# EAGLE design 14044-sparkfun-mlx90640-qwiic-breakout-panel-new (EAGLE 9.0.1)
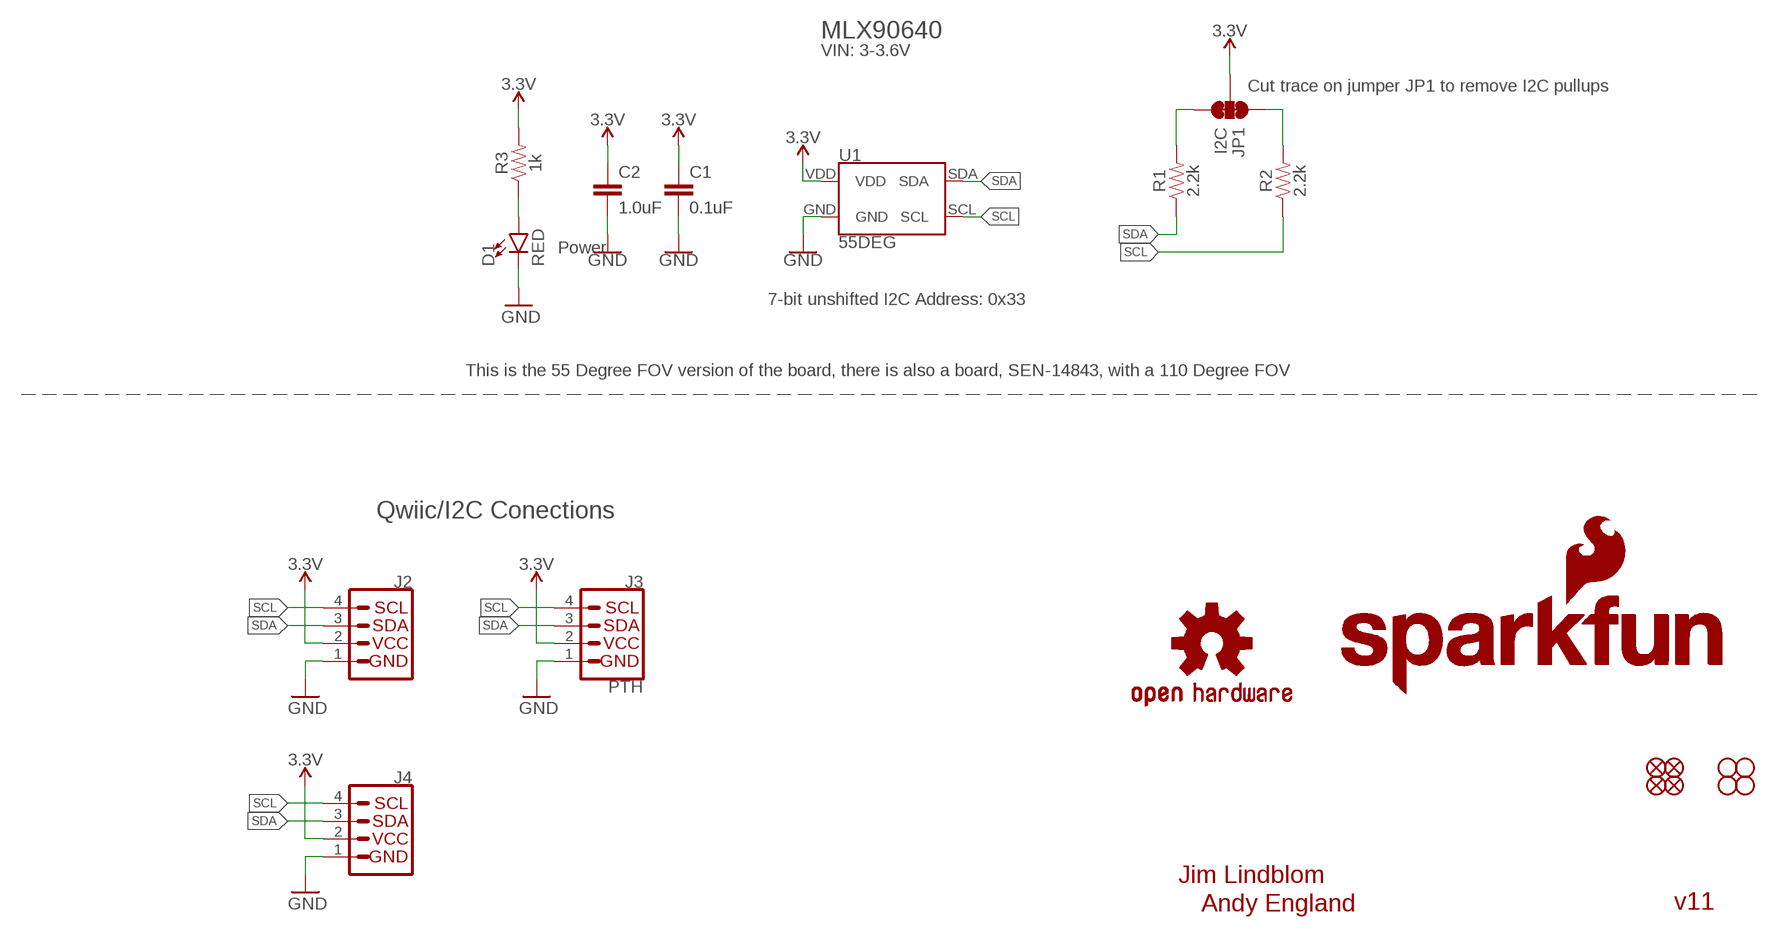
[diagram p0: schematic, sheet 1]

## Parts
C1  0.1uF  0.1UF-0603-25V-(+80/-20%)  [0603]
C2  1.0uF  1.0UF-0603-16V-10%  [0603]
D1  RED  LED-RED0603  [LED-0603]
J2  QWIIC_CONNECTORJS-1MM  [1X04_1MM_RA]
J3  PTH  I2C_STANDARD_NO_SILK  [1X04_NO_SILK]
J4  QWIIC_CONNECTORJS-1MM  [1X04_1MM_RA]
JP1  I2C  JUMPER-SMT_3_2-NC_TRACE_NO-SILK  [SMT-JUMPER_3_2-NC_TRACE_NO-SILK]
JP2  FIDUCIALUFIDUCIAL  [MICRO-FIDUCIAL]
JP3  STAND-OFF  [STAND-OFF]
JP4  STAND-OFF  [STAND-OFF]
JP5  FIDUCIALUFIDUCIAL  [MICRO-FIDUCIAL]
JP6  FIDUCIALUFIDUCIAL  [MICRO-FIDUCIAL]
JP7  FIDUCIALUFIDUCIAL  [MICRO-FIDUCIAL]
JP8  STAND-OFF  [STAND-OFF]
JP9  STAND-OFF  [STAND-OFF]
LOGO1  OSHW-LOGOMINI  [OSHW-LOGO-MINI]
LOGO2  SFE_LOGO_NAME_FLAME.1_INCH  [SFE_LOGO_NAME_FLAME_.1]
LOGO3  SFE_LOGO_NAME.1_INCH  [SFE_LOGO_NAME_.1]
R1  2.2k  2.2KOHM-0603-1/10W-1%  [0603]
R2  2.2k  2.2KOHM-0603-1/10W-1%  [0603]
R3  1k  1KOHM-0603-1/10W-1%  [0603]
U1  55DEG  MLX90540_MLX90640  [MLX90540_MLX90640]

## Nets
3.3V: C1.1 C2.1 J2.2 J3.2(VCC) J4.2 JP1.2 R3.2 U1.VDD
GND: C1.2 C2.2 D1.C J2.1 J3.1(GND) J4.1 U1.GND
N$1: JP1.3 R1.2
N$2: JP1.1 R2.2
N$3: D1.A R3.1
SCL: J2.4 J3.4(SCL) J4.4 R2.1 U1.SCL
SDA: J2.3 J3.3(SDA) J4.3 R1.1 U1.SDA

## Notes on the sheet
- MLX90640
- VIN: 3-3.6V
- Cut trace on jumper JP1 to remove I2C pullups
- Power
- 7-bit unshifted I2C Address: 0x33
- This is the 55 Degree FOV version of the board, there is also a board, SEN-14843, with a 110 Degree FOV
- Qwiic/I2C Conections
- Jim Lindblom
- Andy England | v11

## Library data of the parts
C1 = SparkFun-Capacitors:0.1UF: 0.1µF ceramic capacitors A capacitor is a passive two-terminal electrical component used to store electrical energy temporarily in an electric field.; PROD_ID: CAP-00810
C2 = SparkFun-Capacitors:1.0UF: 1µF ceramic capacitors A capacitor is a passive two-terminal electrical component used to store electrical energy temporarily in an electric field.; PROD_ID: CAP-00868
D1 = SparkFun-LED:LED-RED: Red SMD LED Used in manufacturing of most products at SparkFun Packages: 0603 - SMD 0603 package [Product Link] <http://docs.avagotech.com/docs/AV02-0551EN> 0603 SMART - SMD 0603 SMART package ( more efficient and expensive)[Product Link] <http://www.osram-os.com/Graphics/XPic2/00077099_0.pdf> 1206 - SMD1206 package [Product Link] <https://www.sparkfun.com/datasheets/DevTools/LilyPad/Q150OVS4.pdff> SparkFun Products: Pro Mini 328 -5V <https://www.sparkfun.com/products/821> RedBoard <https://www.sparkfun.com/products/12757> IOIO-OTG <https://www.sparkfun.com/products/13613>; PROD_ID: DIO-00819
J2 J4 = SparkFun-Connectors:QWIIC_CONNECTOR: SparkFun I2C Standard Qwiic Connector An SMD 1mm pitch JST connector makes it easy and quick (get it? Qwiic?) to connect I2C devices to each other. The Qwiic system <http://www.sparkfun.com/qwiic> enables fast and solderless connection between popular platforms and various sensors and actuators. We carry 200mm <https://www.sparkfun.com/products/14204>, 100mm <https://www.sparkfun.com/products/14205>, 50mm <https://www.sparkfun.com/products/14206>, and breadboard friendly <https://www.sparkfun.com/products/14207> Qwiic cables. We also offer 10 pcs strips <https://www.sparkfun.com/products/14323> the SMD connectors.; PROD_ID: CONN-13694
J3 = SparkX:I2C_STANDARD: SparkFun I2C Standard Pinout Header SparkFun has standardized on a pinout for all I2C based sensor breakouts. This pinout allows I2C boards to be plugged directly into the headers on Arduino Uno compatible boards, and to be daisy chained easily. Example SparkFun Products: SparkFun Atmospheric Sensor Breakout - BME280 <https://www.sparkfun.com/products/13676> SparkFun Altitude/Pressure Sensor Breakout - MPL3115A2 <https://www.sparkfun.com/products/11084> SparkFun TOF Range Finder Sensor - VL6180 <https://www.sparkfun.com/products/12785>
JP1 = SparkFun-Jumpers:JUMPER-SMT_3_2-NC_TRACE: Normally closed trace jumper (2 of 2 connections) This jumper has a trace between all three pads so they are normally closed (NC). Use a razor knife to open the connection(s). For best results follow the IPC guidelines for cutting traces: Cutout at least 0.063 mm (0.005 in). Remove all loose material to clean up the cut area. Seal the cut with an approved epoxy. Reapply solder to reclose the connection(s).
JP2 JP5-JP7 = SparkFun:FIDUCIAL: Fiducial Alignment Points Various fiducial points for machine vision alignment.
JP3 JP4 JP8 JP9 = SparkFun:STAND-OFF: Stand Off This is the mechanical footprint for a #4 phillips button head screw. Use the keepout ring to avoid running the screw head into surrounding components. SKU : PRT-00447
LOGO1 = SparkFun-Aesthetics:OSHW-LOGO: Open-Source Hardware (OSHW) Logo This logo indicates the piece of hardware it is found on incorporates a OSHW license and/or adheres to the definition of open source hardware found here: http://freedomdefined.org/OSHW
LOGO2 = SparkFun-Aesthetics:SFE_LOGO_NAME_FLAME: SparkFun Font Logo w/ Flame This is the SparkFun full logo. The logo on the schematic will always be the same size; the package variant is the height of the flame part of the logo. Default layer for the logo on the board is tSilk.
LOGO3 = SparkFun-Aesthetics:SFE_LOGO_NAME: SparkFun Font Logo This is the SparkFun name logo. The logo on the schematic will always be the same size; the package variant is the height of the flame part of the logo (or the height the flame would be, if it were drawn). Default layer for the logo on the board is tSilk.
R1 R2 = SparkFun-Resistors:2.2KOHM: 2.2kΩ resistor A resistor is a passive two-terminal electrical component that implements electrical resistance as a circuit element. Resistors act to reduce current flow, and, at the same time, act to lower voltage levels within circuits. - Wikipedia; PROD_ID: RES-08272
R3 = SparkFun-Resistors:1KOHM: 1kΩ resistor A resistor is a passive two-terminal electrical component that implements electrical resistance as a circuit element. Resistors act to reduce current flow, and, at the same time, act to lower voltage levels within circuits. - Wikipedia; PROD_ID: RES-07856
U1 = SparkFun-IC-Special-Function:MLX90540_MLX90640: Melexis MLX90640 Infrared Array The MLX90640 is a fully calibrated 32x24 pixels thermal IR array in an industry standard 4-lead TO39 package with digital interface.; PROD_ID: IC-14042

## Board
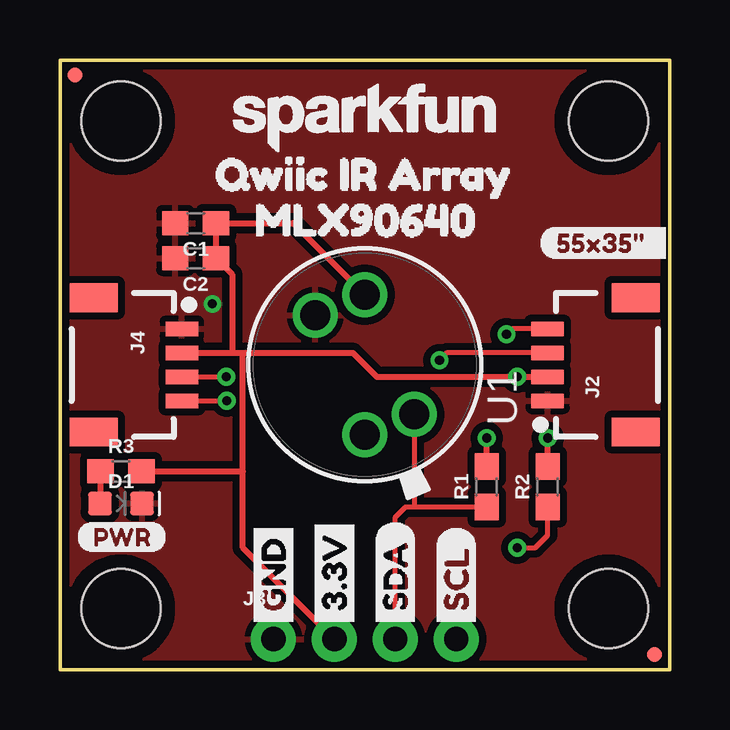
[diagram p1: board, top side]
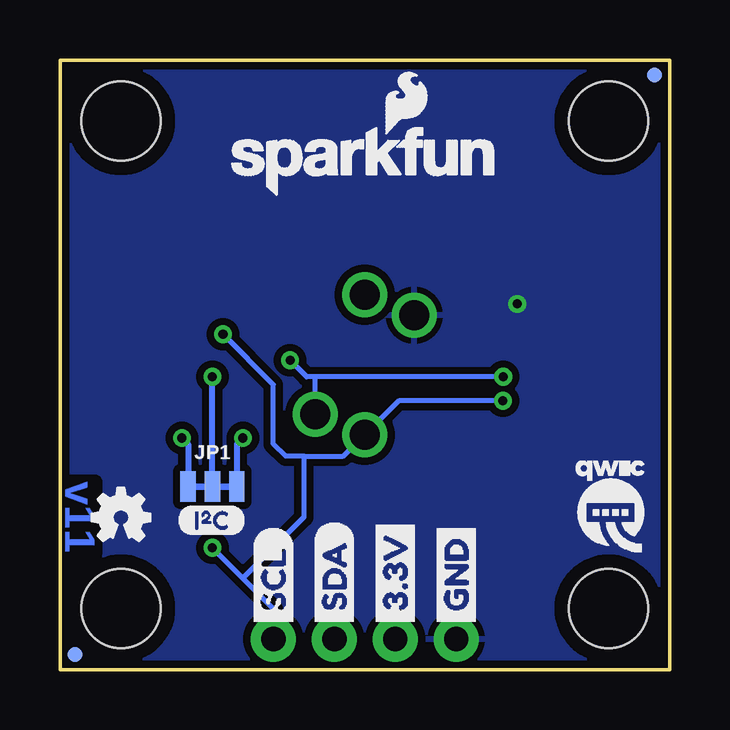
[diagram p2: board, bottom side, seen from below]

Size 25.4 x 25.4 mm. Coordinates in mm from the lower left corner, seen from the top.
Outline: 0,0 25.4,0 25.4,25.4 0,25.4 0,0
Copper layers (1*16): Top 0.035mm / dielectric 1.5mm / Bottom 0.035mm
Design rules "SparkFun-2-layer-TIGHT": minimum track width 7mil, minimum drill 15mil, track to track 7mil, track to pad 7mil, pad to pad 7mil, via to via 7mil, smd to smd 7mil, copper to edge 7mil, drill to drill 7mil, minimum pad ring 7mil, minimum via ring 7mil, stop-mask expansion 4mil, vias tented up to drill 25mil, thermal gap 10mil

### Footprints (pad centres in the part's own frame; a part is rotated, then mirrored left to right if it is on the bottom)
0603 = smd 1.1 x 1: 1 -0.85,0; 2 0.85,0
LED-0603 = smd 1 x 1: A -0.877,0; C 0.877,0
1X04_1MM_RA = smd 0.6 x 1.35: 1 -1.5,0; 2 -0.5,0; 3 0.5,0; 4 1.5,0 | smd 1.2 x 2: NC1 2.8,-3.675; NC2 -2.8,-3.675
1X04_NO_SILK = drill 1.016 pad 1.88: 1 0,0; 2 2.54,0; 3 5.08,0; 4 7.62,0
SMT-JUMPER_3_2-NC_TRACE_NO-SILK = smd 0.635 x 1.27: 1 -1.016,0; 2 0,0; 3 1.016,0
MICRO-FIDUCIAL = smd 0.635 x 0.635: 1 0,0
STAND-OFF = hole 3.302: 0,0
MLX90540_MLX90640 = drill 1.25: GND 2.065,2.065; SCL -2.92,0; SDA -2.065,-2.065; VDD 2.92,0

### Placement (x,y rotation side)
C1  5.65,18.61 180 top
C2  5.65,17.14 180 top
D1  2.54,6.92 0 top
J2  20.32,12.7 90 top
J3  8.89,1.27 0 top
J4  5.08,12.7 270 top
JP1  19.05,7.62 0 bottom
JP2  24.77,0.64 0 top
JP3  2.54,22.86 0 top
JP4  22.86,22.86 0 top
JP5  0.64,24.77 0 top
JP6  24.77,0.64 0 bottom
JP7  0.64,24.77 0 bottom
JP8  2.54,2.54 0 top
JP9  22.86,2.54 0 top
LOGO1  22.86,6.35 0 bottom
LOGO2  18.67,19.68 0 bottom
LOGO3  6.73,21.08 0 top
R1  17.78,7.62 90 top
R2  20.32,7.62 90 top
R3  2.54,8.26 0 top
U1  12.7,12.7 90 top
U$1  [SDA-[)]  13.97,1.52 90 top
U$2  [55X35#__0]  19.94,17.78 0 top
U$4  [SCL-[)]  16.51,1.52 90 top
U$5  [3.3V]  11.43,1.52 90 top
U$6  [GND-04]  8.89,1.52 90 top
U$7  [SDA-[)]  13.97,1.52 90 bottom
U$8  [SCL-[)]  16.51,1.52 90 bottom
U$9  [3.3V]  11.43,1.52 90 bottom
U$10  [GND-04]  8.89,1.52 90 bottom
U$11  [QWIIC-LOGO-SMALL]  2.54,6.79 0 bottom
U$12  [PWR-()-03]  0.7,5.52 0 top
U$13  [MLX906401]  6.99,18.73 0 top
U$14  [QWIIC_IR_ARRAY0]  5.33,20.64 0 top
U$16  [I_SUPER2_C-()-03]  20.51,6.22 0 bottom

### Tracks (layer width: path | path; a pad name or v marks a point on that pad's centre or on a via)
3.3V  (via drill 0.38)
  Top 0.254: J4.2 7.18,13.2 | 7.18,13.2 7.62,13.2 | 7.62,13.2 12.2,13.2 13.2,12.2 v19.05,12.2 J2.2 | J3.2 7.62,5.08 7.62,8.26 | 7.62,8.26 7.62,13.2 | R3.2 7.62,8.26 | 7.18,13.2 7.18,16.47 C2.1 C1.1 9.71,18.61 U1.VDD
  Bottom 0.254: JP1.2 v19.05,12.2
GND  (via drill 0.38)
  other vias: 6.35,15.24
  pour Top (isolate 0.305): 0,0 0,25.4 25.4,25.4 25.4,0
  pour Bottom (isolate 0.305): 0,0 0,25.4 25.4,25.4 25.4,0
N$1  (via drill 0.38)
  Top 0.254: R1.2 v17.78,9.65
  Bottom 0.254: v17.78,9.65 18.03,9.4 JP1.3
N$2  (via drill 0.38)
  Top 0.254: R2.2 v20.32,9.65
  Bottom 0.254: v20.32,9.65 20.07,9.4 JP1.1
N$3
  Top 0.254: D1.A 1.69,6.95 R3.1
SCL  (via drill 0.38)
  Top 0.203: J4.4 v6.95,11.2 | J2.4 18.84,14.2 v18.61,13.97 | v19.05,5.08 19.81,5.08 20.32,5.59 R2.1
  Bottom 0.203: v6.95,11.2 11.28,11.2 U1.SCL 13.59,8.89 15.24,8.89 | v18.61,13.97 16.51,11.87 16.51,9.4 16,8.89 15.24,8.89 | J3.4 16.51,2.54 17.78,3.81 | 17.78,3.81 v19.05,5.08 | 15.24,8.89 15.24,6.35 17.78,3.81
SDA  (via drill 0.38)
  Top 0.203: J4.3 v6.93,12.2 | J2.3 16.12,13.2 v15.81,12.89 | R1.1 15.99,6.77 15.24,6.77 14.76,6.77 | 14.76,6.77 14.39,6.77 13.97,6.35 J3.3 | U1.SDA 14.77,6.78 14.76,6.77
  Bottom 0.203: v6.93,12.2 14.77,12.2 | 14.77,12.2 15.12,12.2 v15.81,12.89 | U1.SDA 14.77,12.2

### Text on the board
Bottom: v11